# Altium schematic sheet NFC.SchDoc
size A4
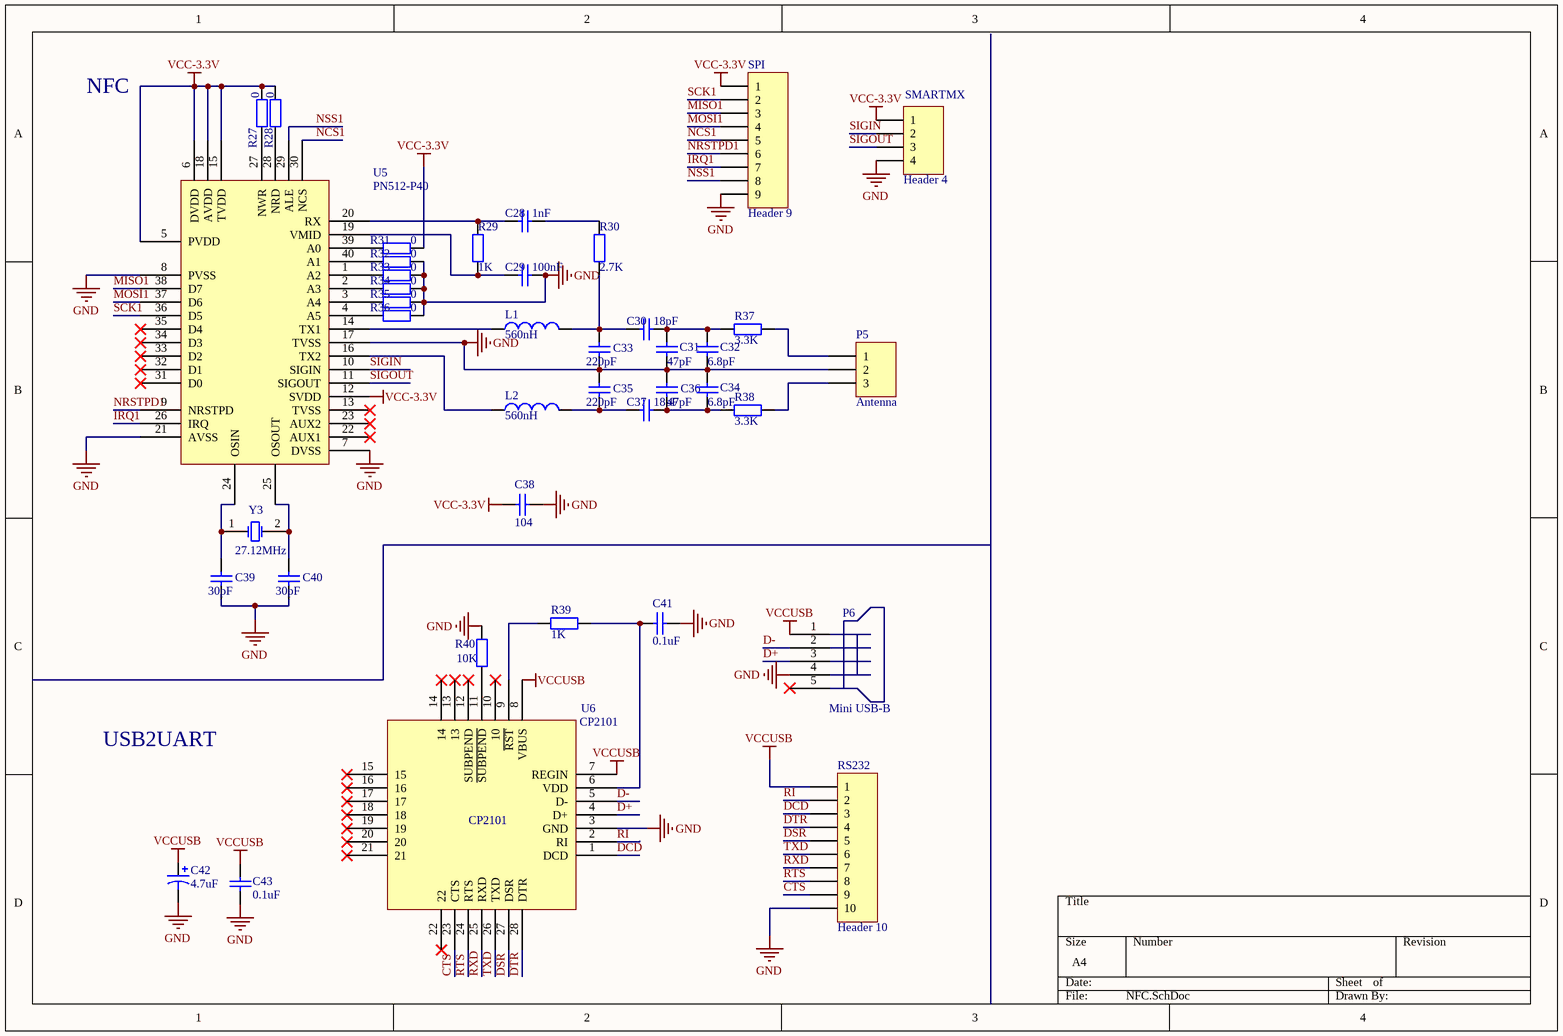
[diagram p0: NFC.SchDoc]

## Parts
C28  value 1nF  [1608[0603]]  (hidden comment: Cap)
C29  value 100nF  [1608[0603]]  (hidden comment: Cap)
C30  value 18pF  [1608[0603]]  (hidden comment: Cap)
C31  value 47pF  [1608[0603]]  (hidden comment: Cap)
C32  value 6.8pF  [1608[0603]]  (hidden comment: Cap)
C33  value 220pF  [1608[0603]]  (hidden comment: Cap)
C34  value 6.8pF  [1608[0603]]  (hidden comment: Cap)
C35  value 220pF  [1608[0603]]  (hidden comment: Cap)
C36  value 47pF  [1608[0603]]  (hidden comment: Cap)
C37  value 18pF  [1608[0603]]  (hidden comment: Cap)
C38  value 104  [1608[0603]]  (hidden comment: Cap)
C39  value 30pF  [1608[0603]]  (hidden comment: Cap)
C40  value 30pF  [1608[0603]]  (hidden comment: Cap)
C41  value 0.1uF  [1608[0603]]  (hidden comment: Cap)
C42  value 4.7uF  [2012[0805] - POL]  (hidden comment: CAP POL)
C43  value 0.1uF  [1608[0603]]  (hidden comment: Cap)
L1  value 560nH  [0402-A]  (hidden comment: Inductor)
L2  value 560nH  [0402-A]  (hidden comment: Inductor)
P5  Antenna  [HDR1X3]
P6  Mini USB-B  [MINI USB-501]
R27  value 0  [1608[0603]]  (hidden comment: RES)
R28  value 0  [1608[0603]]  (hidden comment: RES)
R29  value 1K  [1608[0603]]  (hidden comment: RES)
R30  value 2.7K  [1608[0603]]  (hidden comment: RES)
R31  value 0  [1608[0603]]  (hidden comment: RES)
R32  value 0  [1608[0603]]  (hidden comment: RES)
R33  value 0  [1608[0603]]  (hidden comment: RES)
R34  value 0  [1608[0603]]  (hidden comment: RES)
R35  value 0  [1608[0603]]  (hidden comment: RES)
R36  value 0  [1608[0603]]  (hidden comment: RES)
R37  value 3.3K  [1608[0603]]  (hidden comment: RES)
R38  value 3.3K  [1608[0603]]  (hidden comment: RES)
R39  value 1K  [1608[0603]]  (hidden comment: Res)
R40  value 10K  [1608[0603]]  (hidden comment: Res)
RS232  Header 10  [HDR1X10]
SMARTMX  Header 4  [HDR1X4]
SPI  Header 9  [HDR1X9]
U5  PN512-P40  [QFN50P600X600-40VN]
U6  CP2101  [QFN50P500X500-28VAN]
Y3  27.12MHz  [XTAL]

## Nets
GND: C29.2 C31.1 C32.1 C33.1 C34.2 C35.2 C36.2 C38.1 C39.1 C40.1 C41.1 C42.2 C43.1 P5.2 P6.4 R32.1 R33.1 R34.1 R35.1 R36.1 R40.2 RS232.10 SMARTMX.4 SPI.9 U5.7(DVSS) U5.8(PVSS) U5.17(TVSS) U5.21(AVSS) U6.3(GND)
VCC-3.3V: C38.2 R27.2 R28.2 R31.1 SMARTMX.1 SPI.1 U5.5(PVDD) U5.6(DVDD) U5.12(SVDD) U5.15(TVDD) U5.18(AVDD)
VCCUSB: C42.1 C43.2 P6.1 RS232.1 U6.7(REGIN) U6.8(VBUS)
CTS: RS232.9 U6.23(CTS)
D+: P6.3 U6.4(D+)
D-: P6.2 U6.5(D-)
DCD: RS232.3 U6.1(DCD)
DSR: RS232.5 U6.27(DSR)
DTR: RS232.4 U6.28(DTR)
IRQ1: SPI.7 U5.26(IRQ)
MISO1: SPI.3 U5.38(D7)
MOSI1: SPI.4 U5.37(D6)
NCS1: SPI.5 U5.30(NCS)
NRSTPD1: SPI.6 U5.9(NRSTPD)
NSS1: SPI.8 U5.29(ALE)
RI: RS232.2 U6.2(RI)
RTS: RS232.8 U6.24(RTS)
RXD: RS232.7 U6.25(RXD)
SCK1: SPI.2 U5.36(D5)
SIGIN: SMARTMX.2 U5.10(SIGIN)
SIGOUT: SMARTMX.3 U5.11(SIGOUT)
TXD: RS232.6 U6.26(TXD)
NetC28_1: C28.1 R29.2 U5.20(RX)
NetC28_2: C28.2 R30.2
NetC29_1: C29.1 R29.1 U5.19(VMID)
NetC30_1: C30.1 C33.2 L1.2 R30.1
NetC30_2: C30.2 C31.2 C32.2 R37.2
NetC34_1: C34.1 C36.1 C37.2 R38.2
NetC35_1: C35.1 C37.1 L2.2
NetC39_2: C39.2 U5.24(OSIN) Y3.1(OSC1)
NetC40_2: C40.2 U5.25(OSOUT) Y3.2(OSC2)
NetC41_2: C41.2 R39.1 U6.6(VDD)
NetL1_1: L1.1 U5.14(TX1)
NetL2_1: L2.1 U5.16(TX2)
NetP5_1: P5.1 R37.1
NetP5_3: P5.3 R38.1
NetR27_1: R27.1 U5.27(NWR)
NetR28_1: R28.1 U5.28(NRD)
NetR31_2: R31.2 U5.39(A0)
NetR32_2: R32.2 U5.40(A1)
NetR33_2: R33.2 U5.1(A2)
NetR34_2: R34.2 U5.2(A3)
NetR35_2: R35.2 U5.3(A4)
NetR36_2: R36.2 U5.4(A5)
NetR39_2: R39.2 U6.9(~{RST})
NetR40_1: R40.1 U6.11(~{SUBPEND})

Not connected (* = marked no-connect by the designer): P6 5*; U5 13(TVSS)* 22(AUX1)* 23(AUX2)* 31(D0)* 32(D1)* 33(D2)* 34(D3)* 35(D4)*; U6 10* 12(SUBPEND)* 13* 14* 15* 16* 17* 18* 19* 20* 21* 22*

## Notes on the sheet
- NFC
- USB2UART

## Library data of the parts
C28-C41 C43 = Cap: Capacitor; Published: 8-Jun-2000; LatestRevisionDate: 17-Jul-2002; LatestRevisionNote: Re-released for DXP Platform.; Publisher: Altium Limited
C42 = CAP POL: Polarized Capacitor (Axial); Published: 8-Jun-2000; LatestRevisionDate: 17-Jul-2002; LatestRevisionNote: Re-released for DXP Platform.; Publisher: Altium Limited
L1 L2 = Inductor: Code_IEC: 1005; Published: 8-Jun-2000; LatestRevisionDate: 17-Jul-2002; LatestRevisionNote: Re-released for DXP Platform.; PackageReference: 0402-A; Publisher: Altium Limited; Code_JEITA: 0402
P5 = Header 3: Header, 3-Pin; LatestRevisionDate: 17-Jul-2002; LatestRevisionNote: Re-released for DXP Platform.; Publisher: Altium Limited
P6 = USB: Mini USB Type B
R27-R40 = RES: Resistor; Published: 8-Jun-2000; LatestRevisionDate: 17-Jul-2002; LatestRevisionNote: Re-released for DXP Platform.; Publisher: Altium Limited
RS232 = Header 10: Header, 10-Pin; LatestRevisionDate: 17-Jul-2002; LatestRevisionNote: Re-released for DXP Platform.; Publisher: Altium Limited
SMARTMX = Header 4: Header, 4-Pin; LatestRevisionDate: 17-Jul-2002; LatestRevisionNote: Re-released for DXP Platform.; Publisher: Altium Limited
SPI = Header 9: Header, 9-Pin; LatestRevisionDate: 17-Jul-2002; LatestRevisionNote: Re-released for DXP Platform.; Publisher: Altium Limited
U5 = PN511-P40
Y3 = XTAL: Crystal Oscillator; Published: 8-Jun-2000; Revision: July-2002: Re-released for DXP Platform.; Publisher: Altium Limited